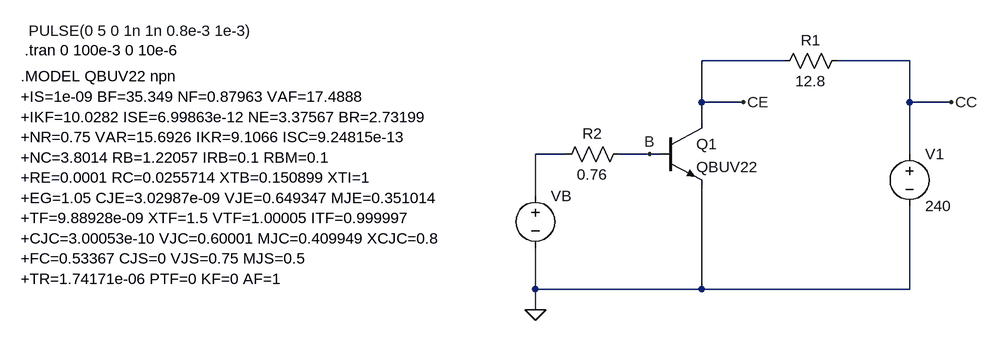
[diagram p0: schematic questao_3_parte_2.asc]
questao_3_parte_2.asc, the LTspice schematic file:
Version 4
SHEET 1 1596 680
WIRE 576 0 448 0
WIRE 768 0 656 0
WIRE 448 64 448 0
WIRE 512 64 448 64
WIRE 768 64 768 0
WIRE 832 64 768 64
WIRE 448 96 448 64
WIRE 240 144 192 144
WIRE 368 144 320 144
WIRE 384 144 368 144
WIRE 768 144 768 64
WIRE 192 208 192 144
WIRE 192 352 192 288
WIRE 448 352 448 192
WIRE 448 352 192 352
WIRE 768 352 768 224
WIRE 768 352 448 352
WIRE 192 384 192 352
FLAG 192 384 0
FLAG 368 144 B
FLAG 512 64 CE
FLAG 832 64 CC
SYMBOL res 672 -16 R90
WINDOW 0 0 56 VBottom 2
WINDOW 3 32 56 VTop 2
SYMATTR InstName R1
SYMATTR Value 12.8
SYMBOL npn 384 96 R0
SYMATTR InstName Q1
SYMATTR Value QBUV22
SYMBOL voltage 768 128 R0
WINDOW 123 0 0 Left 0
WINDOW 39 0 0 Left 0
SYMATTR InstName V1
SYMATTR Value 240
SYMBOL voltage 192 192 R0
WINDOW 123 0 0 Left 0
WINDOW 39 0 0 Left 0
WINDOW 3 -780 -238 Left 2
SYMATTR InstName VB
SYMATTR Value PULSE(0 5 0 1n 1n 0.8e-3 1e-3)
SYMBOL res 336 128 R90
WINDOW 0 0 56 VBottom 2
WINDOW 3 32 56 VTop 2
SYMATTR InstName R2
SYMATTR Value 0.76
TEXT -594 -16 Left 2 !.tran 0 100e-3 0 10e-6
TEXT -600 24 Left 2 !.MODEL QBUV22 npn\n+IS=1e-09 BF=35.349 NF=0.87963 VAF=17.4888\n+IKF=10.0282 ISE=6.99863e-12 NE=3.37567 BR=2.73199\n+NR=0.75 VAR=15.6926 IKR=9.1066 ISC=9.24815e-13\n+NC=3.8014 RB=1.22057 IRB=0.1 RBM=0.1\n+RE=0.0001 RC=0.0255714 XTB=0.150899 XTI=1\n+EG=1.05 CJE=3.02987e-09 VJE=0.649347 MJE=0.351014\n+TF=9.88928e-09 XTF=1.5 VTF=1.00005 ITF=0.999997\n+CJC=3.00053e-10 VJC=0.60001 MJC=0.409949 XCJC=0.8\n+FC=0.53367 CJS=0 VJS=0.75 MJS=0.5\n+TR=1.74171e-06 PTF=0 KF=0 AF=1

The netlist it stands for:
* questao_3_parte_2.asc
R1 CC CE 12.8
Q1 CE B 0 0 QBUV22
V1 CC 0 240
VB N001 0 PULSE(0 5 0 1n 1n 0.8e-3 1e-3)
R2 B N001 0.76
.model NPN NPN
.model PNP PNP
.lib standard.bjt
.tran 0 100e-3 0 10e-6
.MODEL QBUV22 npn
+IS=1e-09 BF=35.349 NF=0.87963 VAF=17.4888
+IKF=10.0282 ISE=6.99863e-12 NE=3.37567 BR=2.73199
+NR=0.75 VAR=15.6926 IKR=9.1066 ISC=9.24815e-13
+NC=3.8014 RB=1.22057 IRB=0.1 RBM=0.1
+RE=0.0001 RC=0.0255714 XTB=0.150899 XTI=1
+EG=1.05 CJE=3.02987e-09 VJE=0.649347 MJE=0.351014
+TF=9.88928e-09 XTF=1.5 VTF=1.00005 ITF=0.999997
+CJC=3.00053e-10 VJC=0.60001 MJC=0.409949 XCJC=0.8
+FC=0.53367 CJS=0 VJS=0.75 MJS=0.5
+TR=1.74171e-06 PTF=0 KF=0 AF=1
.backanno
.end